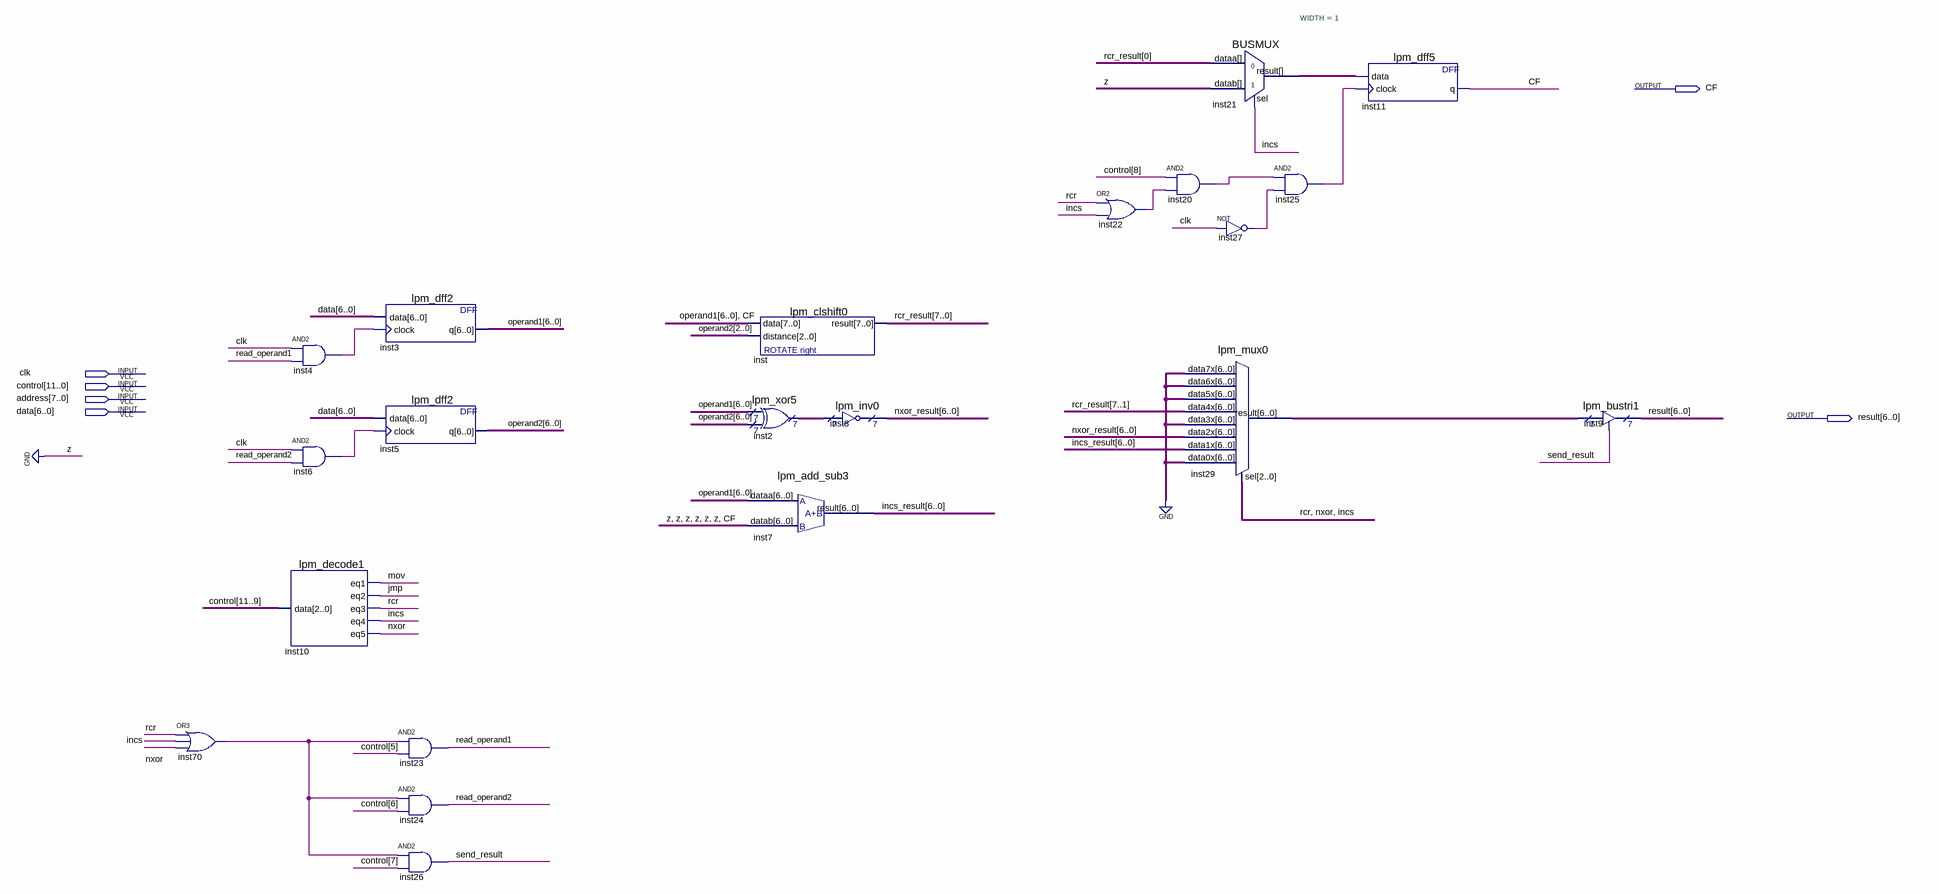
[diagram p0: schematic sheet]
// Quartus schematic ALD.bdf as structural Verilog: 21 symbols, 6 pins
module ALD (
  input  clk,
  input  [11:0] control,
  input  [7:0] address,
  input  [6:0] data,
  output CF,
  output [6:0] result
);

  wire incs, inst4_out, inst6_out, inst20_out, inst21_result, inst22_out, inst25_out, inst27_out, inst70_out,
       jmp, mov, nxor, rcr, read_operand1, read_operand2, send_result;
  wire [6:0] incs_result, inst2_result, inst29_result, nxor_result, operand1, operand2;
  wire [7:0] rcr_result;

  or inst70 (inst70_out, rcr, incs, nxor);
  and inst4 (inst4_out, clk, read_operand1);
  and inst6 (inst6_out, clk, read_operand2);
  lpm_decode1 inst10 (.data(control[11:9]), .eq1(mov), .eq2(jmp), .eq3(rcr), .eq4(incs), .eq5(nxor));
  lpm_dff2 inst3 (.data(data), .clock(inst4_out), .q(operand1));
  lpm_dff2 inst5 (.data(data), .clock(inst6_out), .q(operand2));
  and inst23 (read_operand1, inst70_out, control[5]);
  and inst24 (read_operand2, inst70_out, control[6]);
  and inst26 (send_result, inst70_out, control[7]);
  lpm_clshift0 inst (.data({operand1, CF}), .distance(operand2[2:0]), .result(rcr_result));
  lpm_xor5 inst2 (.data0x(operand1), .data1x(operand2), .result(inst2_result));
  lpm_add_sub3 inst7 (.dataa(operand1), .datab({{6{1'b0}}, CF}), .result(incs_result));
  lpm_inv0 inst8 (.data(inst2_result), .result(nxor_result));
  or inst22 (inst22_out, rcr, incs);
  and inst20 (inst20_out, control[8], inst22_out);
  BUSMUX #(.WIDTH(1)) inst21 (.datab(1'b0), .sel(incs), .dataa(rcr_result[0]), .result(inst21_result));
  not inst27 (inst27_out, clk);
  lpm_mux0 inst29 (
    .data7x({7{1'b0}}), .data6x({7{1'b0}}), .data5x({7{1'b0}}), .data4x(rcr_result[7:1]), .data3x({7{1'b0}}),
    .data2x(nxor_result), .data1x(incs_result), .data0x({7{1'b0}}), .sel({rcr, nxor, incs}),
    .result(inst29_result));
  and inst25 (inst25_out, inst20_out, inst27_out);
  lpm_dff5 inst11 (.data(inst21_result), .clock(inst25_out), .q(CF));
  lpm_bustri1 inst9 (.enabledt(send_result), .data(inst29_result), .tridata(result));
endmodule
